# Altium schematic sheet Memory Nor Flash.SchDoc
size A4
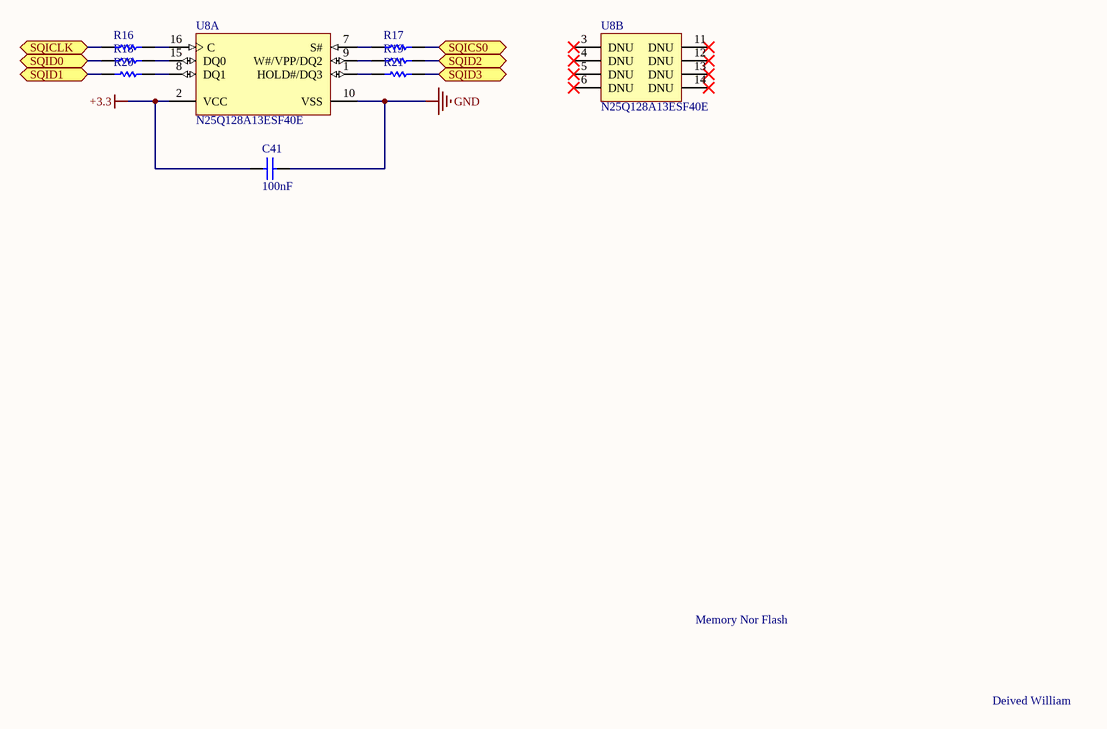
[diagram p0: Memory Nor Flash.SchDoc]

## Parts
C41  value 100nF  [WCAP-CSGP_0603, 1.6x0.8x0.8mm_Reflow]  (hidden comment: 885012206020)
R16  50R  [3-0603]  (value not drawn)
R17  50R  [3-0603]  (value not drawn)
R18  50R  [3-0603]  (value not drawn)
R19  50R  [3-0603]  (value not drawn)
R20  50R  [3-0603]  (value not drawn)
R21  50R  [3-0603]  (value not drawn)
U8  N25Q128A13ESF40E  [MICT-SF-16_N]  (parts A,B of 2)

## Ports
SQICLK, SQICS0, SQID0, SQID1, SQID2, SQID3

## Nets
+3.3: C41.1 U8.2(VCC)
GND: C41.2 U8.10(VSS)
SQICLK: R16.1 ; port SQICLK
SQICS0: R17.2 ; port SQICS0
SQID0: R18.1 ; port SQID0
SQID1: R20.1 ; port SQID1
SQID2: R19.2 ; port SQID2
SQID3: R21.2 ; port SQID3
NetR16_2: R16.2 U8.16(C)
NetR17_1: R17.1 U8.7(S#)
NetR18_2: R18.2 U8.15(DQ0)
NetR19_1: R19.1 U8.9(W#/VPP/DQ2)
NetR20_2: R20.2 U8.8(DQ1)
NetR21_1: R21.1 U8.1(HOLD#/DQ3)

Not connected (* = marked no-connect by the designer): U8 3(DNU)* 4(DNU)* 5(DNU)* 6(DNU)* 11(DNU)* 12(DNU)* 13(DNU)* 14(DNU)*

## Notes on the sheet
- Memory Nor Flash
- Deived William

## Library data of the parts
C41 = 885012206020: WCAP-CSGP Ceramic Capacitors, size 0603, 1.6x0.8x0.8mm, 10V, X7R, 100nF; Rated Voltage: 10V DC; ComponentLink1Description: Manufacturer; ComponentLink1URL: http://www.we-online.de; ComponentLink2Description: Datasheet; ComponentLink2URL: http://katalog.we-online.de/pbs/datasheet/885012206020.pdf; Part Number: 885012206020; Published Date: June 2017; Publisher: Wurth Elektronik; Size: 0603, 1.6x0.8x0.8mm; Ceramic Type: X7R
R16-R21 = ERJ3RE: Precision Thick Film Chip Resistor, 10 Ohm to 1M Ohm Range, 1% and 0.5% Tolerance, 0603 Size, 0.063 W; Published: 17-Dec-2003; LatestRevisionDate: 19-Mar-2004; LatestRevisionNote: Silkscreen size reduced.; PackageDocument: Mar-2003; PackageReference: 3-0603; Publisher: Altium Limited; Code_IPC: 1608 [0603]; ComponentLink1Description: Manufacturer Link; ComponentLink1URL: http://www.panasonic.com/industrial/components/resistive_products.htm; ComponentLink2Description: Datasheet; ComponentLink2URL: http://www.panasonic.com/industrial/components/pdf/AOA0000CE2.pdf
U8 = N25Q128A13ESF40E: 128 Mb (x1/x2/x4) Serial NOR Flash Memory with Multi I/O, 108 MHz, 2.7 to 3.6 V, 16-pin SO16 Wide (SF), Tray; Part Family: N25Q; Manufacturer: Micron; Density: 128Mb; Speed: 108 MHz; Voltage: 2.7V-3.6V; DatasheetVersion: Rev. L; PackageVersion: Rev. F; PackageReference: MICT-SF-16; PackageDescription: 16-Pin SO Wide, 7.5 X 10.3 mm, Pitch 1.27 mm; Applications: Embedded; Package: SO16 Wide; Part Status: Production; RoHS: Yes; Type: Multi I/O; Width: x1/x2/x4; Mounting Technology: Surface Mount; PartNumber: N25Q128A13ESF40E; ComponentLink1Description: Manufacturer URL; ComponentLink1URL: http://www.micron.com/; ComponentLink2Description: Datasheet; ComponentLink2URL: http://www.micron.com/~/media/Documents/Products/Data%20Sheet/NOR%20Flash/Serial%20NOR/N25Q/n25q_128mb_3v_65nm.pdf; ComponentLink3Description: Package Specification; ComponentLink3URL: http://www.micron.com/~/media/Documents/Products/Data%20Sheet/NOR%20Flash/Serial%20NOR/N25Q/n25q_1gb_3v_65nm.pdf